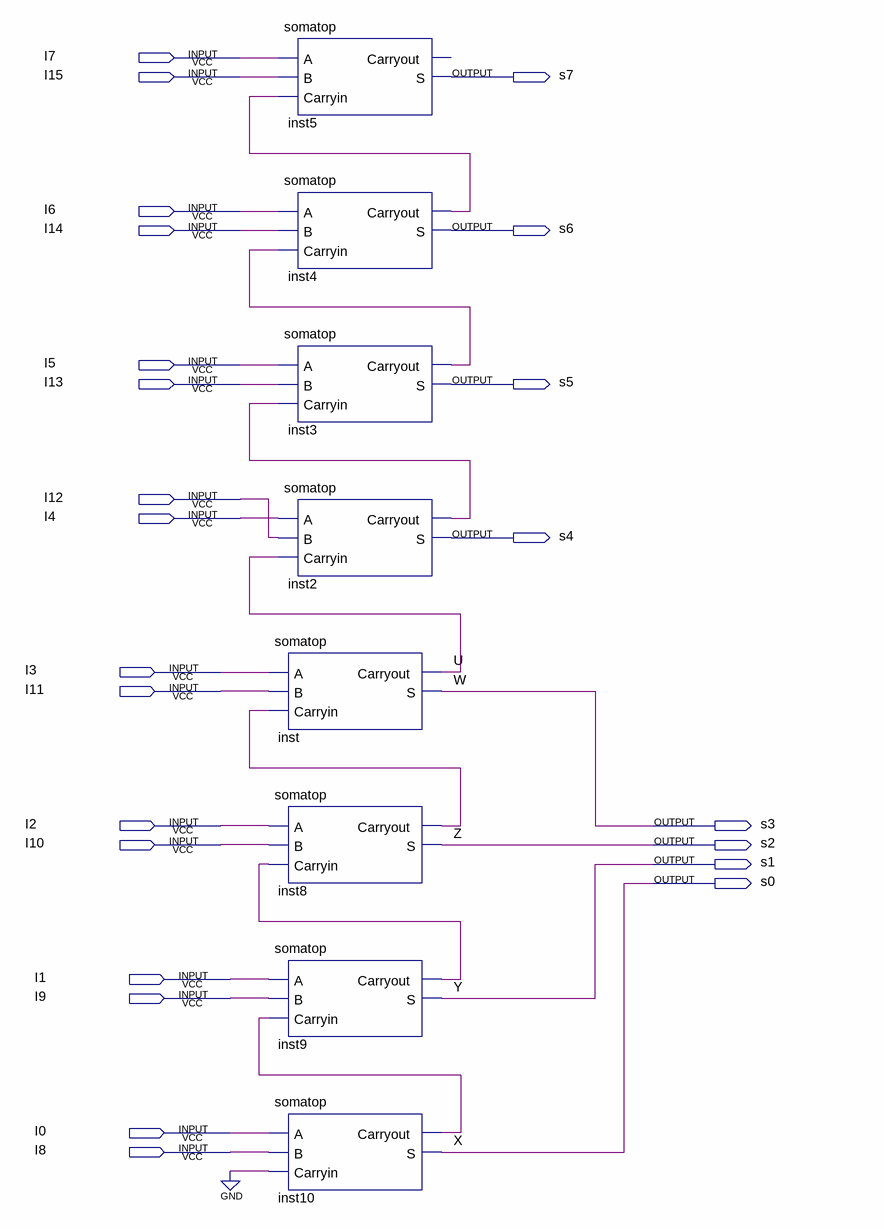
[diagram p0: schematic sheet]
// Quartus schematic 8bitAdder.bdf as structural Verilog: 8 symbols, 24 pins
module \8bitAdder  (
  input  I7,
  input  I15,
  input  I6,
  input  I14,
  input  I5,
  input  I13,
  input  I12,
  input  I4,
  input  I3,
  input  I11,
  input  I2,
  input  I10,
  input  I1,
  input  I9,
  input  I0,
  input  I8,
  output s7,
  output s6,
  output s5,
  output s4,
  output s3,
  output s2,
  output s1,
  output s0
);

  wire inst2_carryout, inst3_carryout, inst4_carryout, inst8_carryout, inst9_carryout, inst10_carryout, U;

  somatop inst5 (.A(I7), .B(I15), .Carryin(inst4_carryout), .S(s7));  // open: Carryout
  somatop inst4 (.A(I6), .B(I14), .Carryin(inst3_carryout), .Carryout(inst4_carryout), .S(s6));
  somatop inst3 (.A(I5), .B(I13), .Carryin(inst2_carryout), .Carryout(inst3_carryout), .S(s5));
  somatop inst2 (.A(I4), .B(I12), .Carryin(U), .Carryout(inst2_carryout), .S(s4));
  somatop inst (.A(I3), .B(I11), .Carryin(inst8_carryout), .Carryout(U), .S(s3));
  somatop inst8 (.A(I2), .B(I10), .Carryin(inst9_carryout), .Carryout(inst8_carryout), .S(s2));
  somatop inst9 (.A(I1), .B(I9), .Carryin(inst10_carryout), .Carryout(inst9_carryout), .S(s1));
  somatop inst10 (.A(I0), .B(I8), .Carryin(1'b0), .Carryout(inst10_carryout), .S(s0));

  // Other names for the same wires on the sheet: X = s0; Y = s1; W = s3; Z = s2
endmodule
